# EAGLE design 2019-02-10-can-display-v7 (EAGLE 9.3.0)

## Sheet 1 of 2
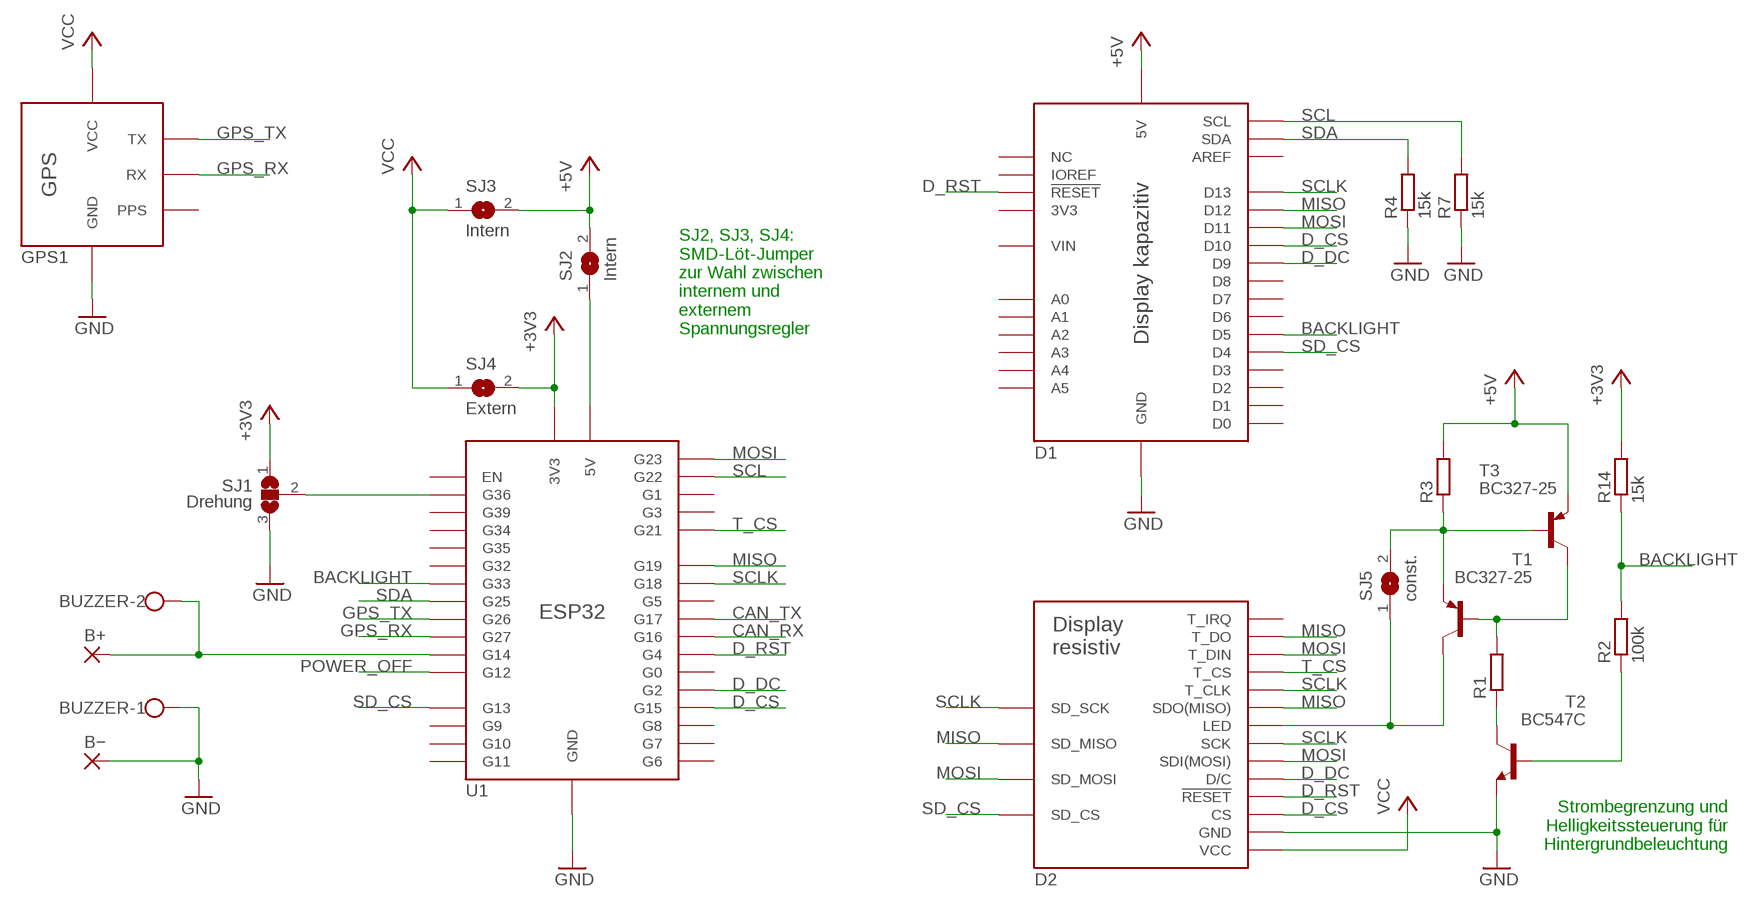
[diagram p0: schematic, sheet 1]

### Parts
B+  WIREPADSMD5-2,5  [5-2,5]
BUZZER  W237-102  [W237-102]
B−  WIREPADSMD5-2,5  [5-2,5]
D1  TFT-KAPAZITIV  [TFT-KAPAZITIV]
D2  TFT-RESISTIV  [TFT-RESISTIVE]
GPS1  GPS  [GPS]
R1  R-EU_VMTA55  [VMTA55]
R2  100k  R-EU_VMTA55  [VMTA55]
R3  R-EU_VMTA55  [VMTA55]
R4  15k  R-EU_VMTA55  [VMTA55]
R7  15k  R-EU_VMTA55  [VMTA55]
R14  15k  R-EU_VMTA55  [VMTA55]
SJ1  Drehung  SJ2W  [SJ_2]
SJ2  Intern  SJ  [SJ]
SJ3  Intern  SJ  [SJ]
SJ4  Extern  SJ  [SJ]
SJ5  const.  SJ  [SJ]
T1  BC327-25  -PNP-TO92  [TO92]
T2  BC547C  -NPN-TO92  [TO92]
T3  BC327-25  -PNP-TO92  [TO92]
U1  ESP32  [ESP32]

### Nets
+3V3: R14.2 SJ1.1 SJ4.2 U1.3V3 U1.3V3S(3V3) ; also sheet 2
+5V: D1.5V R3.2 SJ2.2 SJ3.2 T3.1(E) ; also sheet 2
BACKLIGHT: D1.D5 R2.2 R14.1 U1.G33 U1.G33S(G33)
CAN_RX: U1.G16 ; also sheet 2
CAN_TX: U1.G17 ; also sheet 2
D_CS: D1.D10 D2.LCD_CS(CS) U1.G15
D_DC: D1.D9 D2.LCD_DC(D/C) U1.G2
D_RST: D1.RESET(!RESET!) D2.LCD_RESET(!RESET!) U1.G4
GND: BUZZER.1 B−.1(P) D1.GND@1(GND) D1.GND@2(GND) D1.GND@3(GND) D2.GND GPS1.GND1(GND) GPS1.GND2(GND) R4.1 R7.1 SJ1.3 T2.1(E) U1.GND@1(GND) U1.GND@2(GND) U1.GND@3(GND) U1.GND@4(GND) ; also sheet 2
GPS_RX: GPS1.RX1(RX) GPS1.RX2(RX) U1.G27 U1.G27S(G27)
GPS_TX: GPS1.TX1(TX) GPS1.TX2(TX) U1.G26 U1.G26S(G26)
MISO: D1.D12 D2.LCD_MISO(SDO(MISO)) D2.SD_MISO D2.T_DO U1.G19
MOSI: D1.D11 D2.LCD_MOSI(SDI(MOSI)) D2.SD_MOSI D2.T_DIN U1.G23
N$1: SJ1.2 U1.G36 U1.G36S(G36)
N$2: R1.2 T1.2(B) T3.3(C)
N$3: R3.1 SJ5.2 T1.1(E) T3.2(B)
N$4: R2.1 T2.2(B)
N$5: R1.1 T2.3(C)
N$6: B+.1(P) BUZZER.2 U1.G14 U1.G14S(G14)
N$7: SJ2.1 U1.5V U1.5VS(5V)
N$12: D2.LED SJ5.1 T1.3(C)
POWER_OFF: U1.G12 U1.G12S(G12) ; also sheet 2
SCL: D1.KAP_SCL(SCL) R7.2 U1.G22
SCLK: D1.D13 D2.LCD_SCK(SCK) D2.SD_SCK D2.T_CLK U1.G18
SD_CS: D1.D4 D2.SD_CS U1.G13 U1.G13S(G13)
SDA: D1.KAP_SDA(SDA) R4.2 U1.G25 U1.G25S(G25)
T_CS: D2.T_CS U1.G21
VCC: D2.VCC GPS1.VCC1(VCC) GPS1.VCC2(VCC) SJ3.1 SJ4.1 ; also sheet 2
Unconnected: D1.3V3 D1.A0 D1.A1 D1.A2 D1.A3 D1.A4 D1.A5 D1.AREF D1.D0 D1.D1 D1.D2 D1.D3 D1.D6 D1.D7 D1.D8 D1.IOREF D1.NC@1(NC) D1.VIN D2.T_IRQ GPS1.PPS2(PPS) U1.EN U1.ENS(EN) U1.G0 U1.G1 U1.G3 U1.G5 U1.G6 U1.G7 U1.G8 U1.G9 U1.G9S(G9) U1.G10 U1.G10S(G10) U1.G11 U1.G11S(G11) U1.G32 U1.G32S(G32) U1.G34 U1.G34S(G34) U1.G35 U1.G35S(G35) U1.G39 U1.G39S(G39)

### Notes on the sheet
- SJ2, SJ3, SJ4:
  SMD-Löt-Jumper
  zur Wahl zwischen
  internem und
  externem
  Spannungsregler
- Strombegrenzung und
  Helligkeitssteuerung für
  Hintergrundbeleuchtung

## Sheet 2 of 2
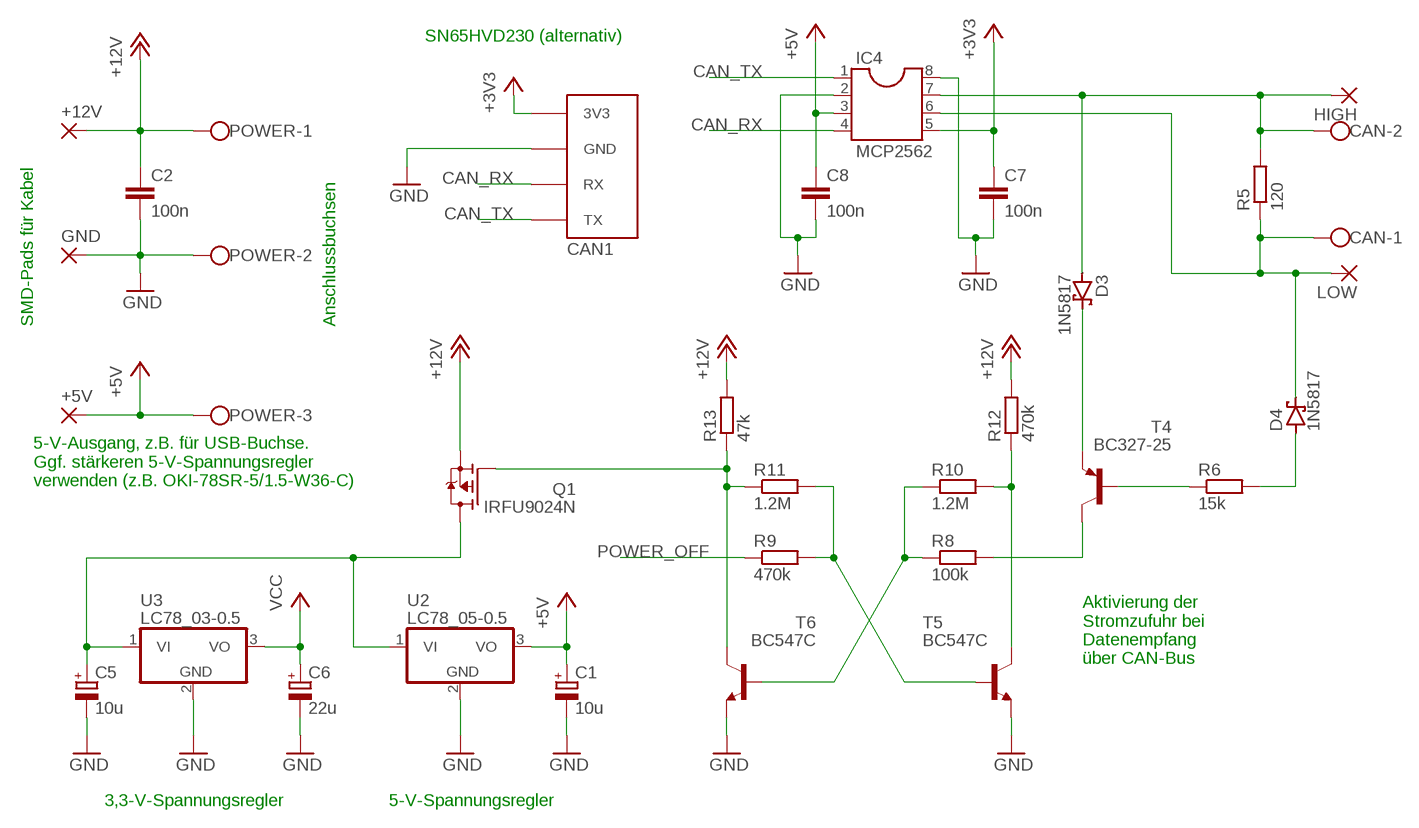
[diagram p1: schematic, sheet 2]

### Parts
+5V  WIREPADSMD5-2,5  [5-2,5]
+12V  WIREPADSMD5-2,5  [5-2,5]
C1  10u  CPOL-EUE1.8-4  [E1,8-4]
C2  100n  C-EU025_050-025X075  [C025_050-025X075]
C5  10u  CPOL-EUE1.8-4  [E1,8-4]
C6  22u  CPOL-EUE1.8-4  [E1,8-4]
C7  100n  C-EU025_050-025X075  [C025_050-025X075]
C8  100n  C-EU025_050-025X075  [C025_050-025X075]
CAN  W237-102  [W237-102]
CAN1  CANBUS  [CANBUS]
D3  1N5817  1N5817-T  [DO41-7.6]
D4  1N5817  1N5817-T  [DO41-7.6]
GND  WIREPADSMD5-2,5  [5-2,5]
HIGH  WIREPADSMD5-2,5  [5-2,5]
IC4  MCP2562  DIL8  [DIL08]
LOW  WIREPADSMD5-2,5  [5-2,5]
POWER  W237-103  [W237-103]
Q1  IRFU9024N  P-CHANNEL-MOSFET  [TO251AA-V]
R5  120  R-EU_VMTA55  [VMTA55]
R6  15k  R-EU_VMTA55  [VMTA55]
R8  100k  R-EU_VMTA55  [VMTA55]
R9  470k  R-EU_VMTA55  [VMTA55]
R10  1.2M  R-EU_VMTA55  [VMTA55]
R11  1.2M  R-EU_VMTA55  [VMTA55]
R12  470k  R-EU_VMTA55  [VMTA55]
R13  47k  R-EU_VMTA55  [VMTA55]
T4  BC327-25  -PNP-TO92  [TO92]
T5  BC547C  -NPN-TO92  [TO92]
T6  BC547C  -NPN-TO92  [TO92]
U2  LC78_05-0.5  SPANNUNGSREGLER  [SPANNUNGSREGLER]
U3  LC78_03-0.5  SPANNUNGSREGLER  [SPANNUNGSREGLER]

### Nets
+3V3: C7.1 CAN1.3V3 IC4.5 ; also sheet 1
+5V: +5V.1(P) C1.+ C8.1 IC4.3 POWER.3 U2.3(VO) ; also sheet 1
+12V: +12V.1(P) C2.1 POWER.1 Q1.3(S) R12.2 R13.2
CAN_RX: CAN1.RX IC4.4 ; also sheet 1
CAN_TX: CAN1.TX IC4.1 ; also sheet 1
GND: C1.- C2.2 C5.- C6.- C7.2 C8.2 CAN1.GND GND.1(P) IC4.2 IC4.8 POWER.2 T5.1(E) T6.1(E) U2.2(GND) U3.2(GND) ; also sheet 1
N$8: D3.C T4.1(E)
N$9: R6.1 T4.2(B)
N$10: D4.A R6.2
N$11: R8.1 R10.1 T6.2(B)
N$13: CAN.2 D3.A HIGH.1(P) IC4.7 R5.2
N$14: CAN.1 D4.C IC4.6 LOW.1(P) R5.1
N$15: R8.2 T4.3(C)
N$16: R9.2 R11.2 T5.2(B)
N$17: R10.2 R12.1 T5.3(C)
N$18: Q1.1(G) R11.1 R13.1 T6.3(C)
N$20: C5.+ Q1.2(D) U2.1(VI) U3.1(VI)
POWER_OFF: R9.1 ; also sheet 1
VCC: C6.+ U3.3(VO) ; also sheet 1

### Notes on the sheet
- SN65HVD230 (alternativ)
- SMD-Pads für Kabel | Anschlussbuchsen
- 5-V-Ausgang, z.B. für USB-Buchse.
  Ggf. stärkeren 5-V-Spannungsregler
  verwenden (z.B. OKI-78SR-5/1.5-W36-C)
- Aktivierung der
  Stromzufuhr bei
  Datenempfang
  über CAN-Bus
- 3,3-V-Spannungsregler | 5-V-Spannungsregler

## Library data of the parts
+5V +12V B+ B− GND HIGH LOW = wirepad:WIREPAD: Wire PAD connect wire on PCB
BUZZER CAN = con-wago-500:W237-102: WAGO SCREW CLAMP; MPN: 237-102; OC_FARNELL: unknown; OC_NEWARK: 70K9898
C1 C5 C6 = rcl:CPOL-EU: POLARIZED CAPACITOR, European symbol; SPICEPREFIX: C
C2 C7 C8 = rcl:C-EU: CAPACITOR, European symbol; SPICEPREFIX: C
CAN1 = CAN-Display:CANBUS: CAN BUS
D1 = CAN-Display:TFT-KAPAZITIV: TFT-Kapazitiv
D2 = CAN-Display:TFT-RESISTIV: TFT-Resistiv
D3 D4 = diode:1N581*: 1.0A SCHOTTKY BARRIER RECTIFIER Source: http://www.diodes.com/datasheets/ds23001.pdf
GPS1 = CAN-Display:GPS: GPS
IC4 = ic-package:DIL8: Dual In Line / Socket
POWER = con-wago-500:W237-103: WAGO SCREW CLAMP; MPN: 237-103; OC_FARNELL: unknown; OC_NEWARK: 18M7116
Q1 = CAN-Display:P-CHANNEL-MOSFET
R1-R14 = rcl:R-EU_: RESISTOR, European symbol; SPICEPREFIX: R
SJ1 = jumper:SJ2W: SMD solder JUMPER
SJ2-SJ5 = jumper:SJ: SMD solder JUMPER
T1 T3 T4 = transistor:*-PNP-: PNP Transistror
T2 T5 T6 = transistor:*-NPN-: NPN Transistror BF959 corrected 2008.03.06
U1 = CAN-Display:ESP32: ESP32 Development Board
U2 U3 = CAN-Display:SPANNUNGSREGLER

## Board
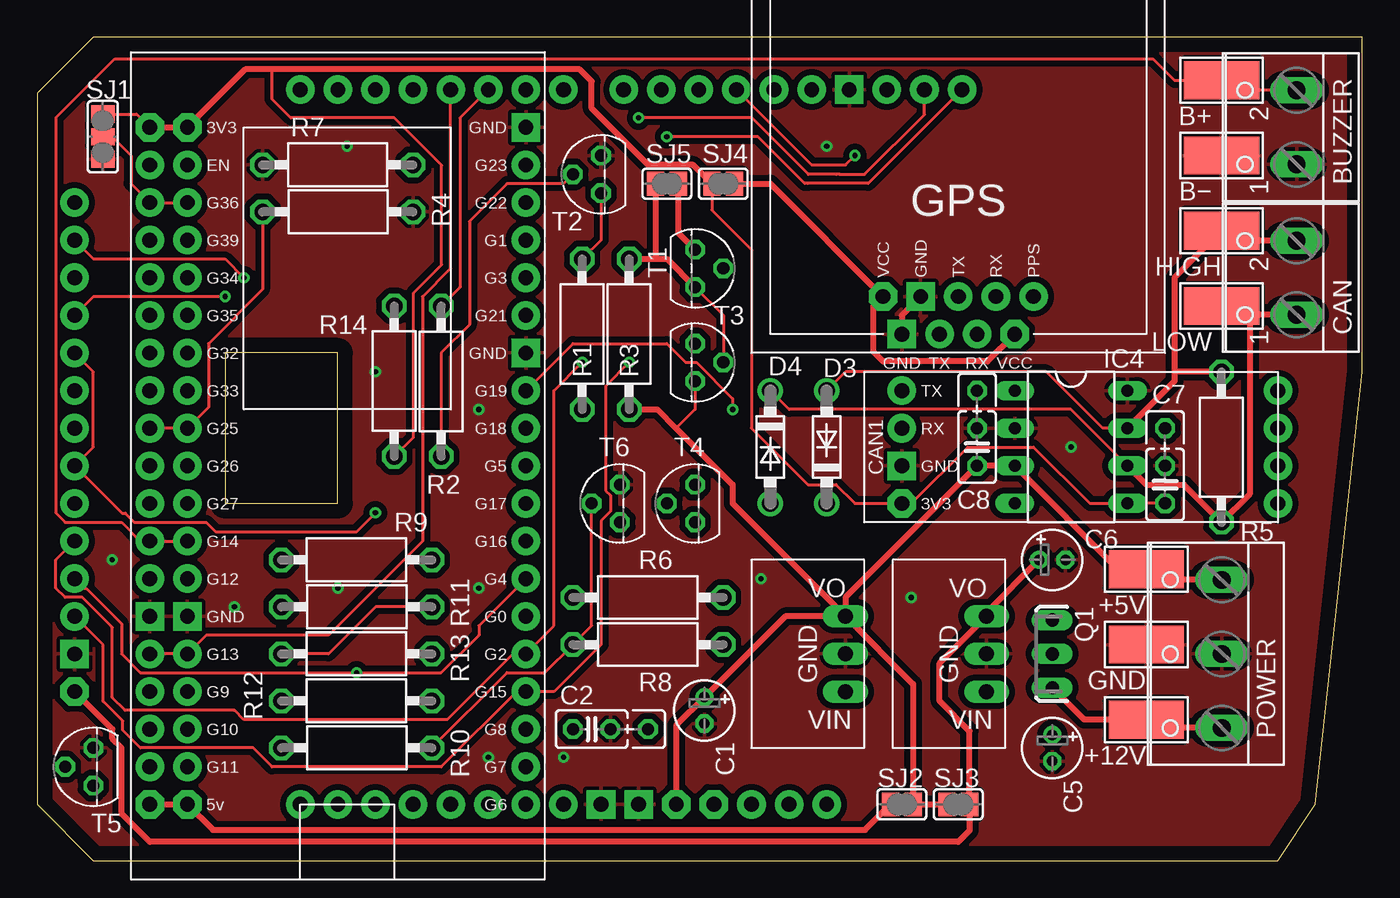
[diagram p2: board, top side]
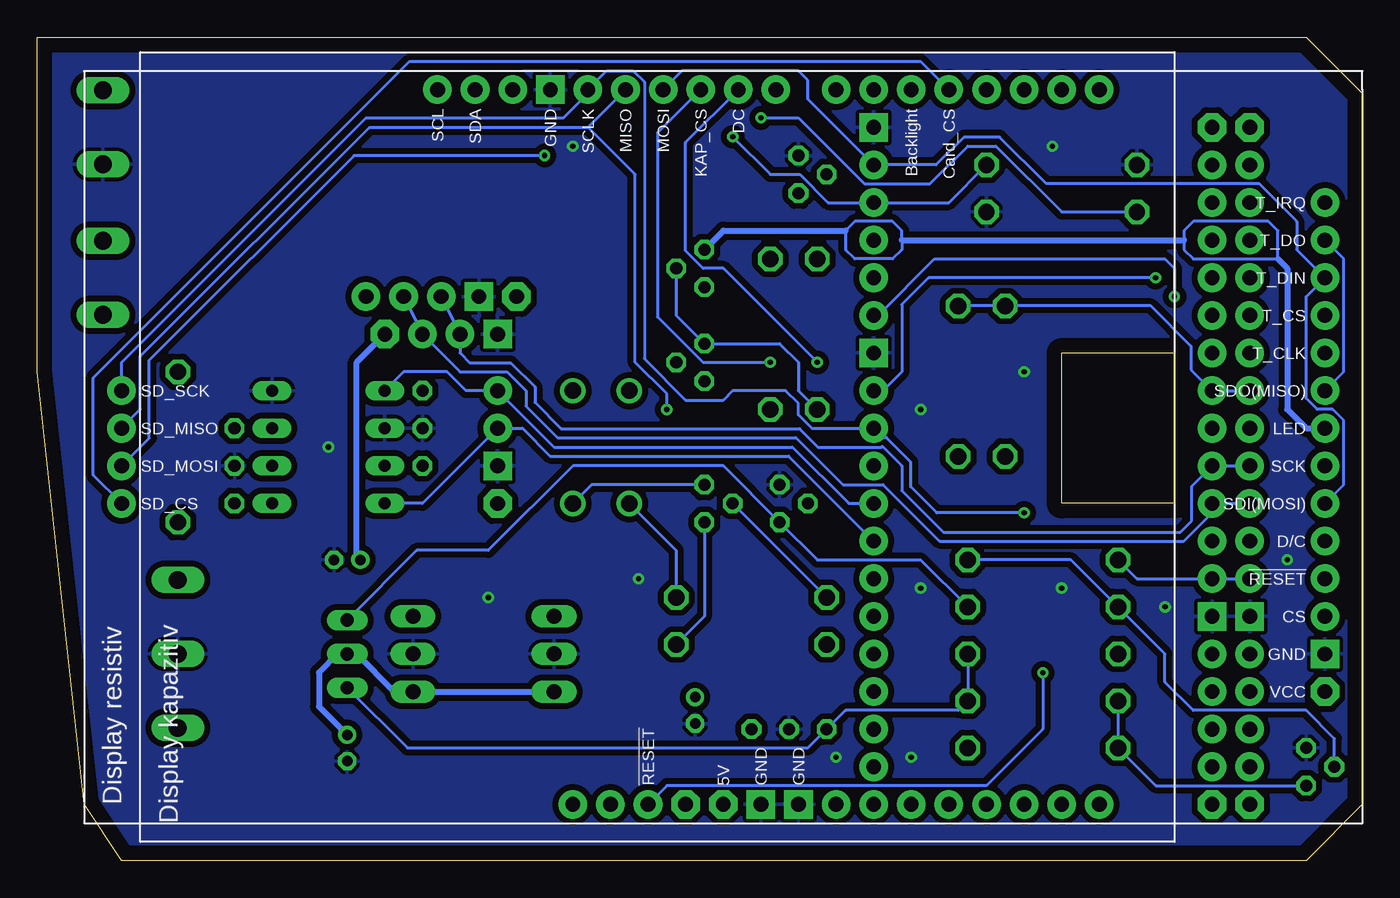
[diagram p3: board, bottom side, seen from below]

Size 89.53 x 55.63 mm. Coordinates in mm from the lower left corner, seen from the top.
Outline: 0,3.81 3.81,0 83.82,0 86.36,3.81 89.53,33.02 89.53,55.63 3.81,55.63 0,51.82 0,3.81
Outline: 20.32,34.29 12.7,34.29 12.7,24.13 20.32,24.13 20.32,34.29
Copper layers (1*16): Top 0.035mm / dielectric 1.5mm / Bottom 0.035mm
Design rules "default *": minimum track width 6mil, minimum drill 0.35mm, track to track 16mil, track to pad 8mil, pad to pad 10mil, via to via 20mil, smd to smd 6mil, copper to edge 40mil, drill to drill 6mil, minimum pad ring 10mil, minimum via ring 8mil, stop-mask expansion 4mil, vias tented up to drill 0mil, thermal gap 10mil

### Footprints (pad centres in the part's own frame; a part is rotated, then mirrored left to right if it is on the bottom)
5-2,5 = smd 2.54 x 5.08: 1 0,0
W237-102 = drill 1.194 long: 1 -2.5,-1.27; 2 2.5,-1.27
E1,8-4 = drill 0.711 pad 1.168: + -0.889,0 | drill 0.711 pad 1.168 octagon: - 0.889,0
C025_050-025X075 = drill 0.813 octagon: 1 -1.27,0; 2 1.27,0; 3 3.81,0
CANBUS = drill 1 pad 1.93 octagon: 3V3 -2.54,-3.81 | drill 1 pad 1.93 square: GND -2.54,-1.27 | drill 1 pad 1.93: RX -2.54,1.27; TX -2.54,3.81
TFT-KAPAZITIV = drill 1 pad 1.93 octagon: 3V3 1.27,-24.13; 5V 3.81,-24.13 | drill 1 pad 1.93: A0 16.51,-24.13; A1 19.05,-24.13; A2 21.59,-24.13; A3 24.13,-24.13; A4 26.67,-24.13; A5 29.21,-24.13; AREF -10.414,24.13; D0 29.21,24.13; D1 26.67,24.13; D2 24.13,24.13; D3 21.59,24.13; D4 19.05,24.13; D5 16.51,24.13; D6 13.97,24.13; D7 11.43,24.13; D8 7.366,24.13; D9 4.826,24.13; D10 2.286,24.13; D11 -0.254,24.13; D12 -2.794,24.13; D13 -5.334,24.13; IOREF -3.81,-24.13; KAP_SCL -15.494,24.13; KAP_SDA -12.954,24.13; NC@1 -6.35,-24.13; RESET -1.27,-24.13; VIN 11.43,-24.13 | drill 1 pad 1.93 square: GND@1 6.35,-24.13; GND@2 8.89,-24.13; GND@3 -7.874,24.13
TFT-RESISTIVE = drill 1 pad 1.93 square: GND 0,-13.97 | drill 1 pad 1.93: LCD_CS 0,-11.43; LCD_DC 0,-6.35; LCD_MISO 0,3.81; LCD_MOSI 0,-3.81; LCD_RESET 0,-8.89; LCD_SCK 0,-1.27; LED 0,1.27; SD_CS -81.28,-3.81; SD_MISO -81.28,1.27; SD_MOSI -81.28,-1.27; SD_SCK -81.28,3.81; T_CLK 0,6.35; T_CS 0,8.89; T_DIN 0,11.43; T_DO 0,13.97; T_IRQ 0,16.51 | drill 1 pad 1.93 octagon: VCC 0,-16.51
DO41-7.6 = drill 1.1 pad 1.7: A 3.81,0; C -3.81,0
GPS = drill 1 pad 1.93 square: GND1 3.81,0; GND2 2.54,-2.54 | drill 1 pad 1.93: PPS2 -5.08,-2.54; RX1 -1.27,0; RX2 -2.54,-2.54; TX1 1.27,0; TX2 0,-2.54 | drill 1 pad 1.93 octagon: VCC1 -3.81,0; VCC2 5.08,-2.54
DIL08 = drill 0.813 long: 1 -3.81,-3.81; 2 -1.27,-3.81; 3 1.27,-3.81; 4 3.81,-3.81; 5 3.81,3.81; 6 1.27,3.81; 7 -1.27,3.81; 8 -3.81,3.81
W237-103 = drill 1.194 long: 1 -5,-1.29; 2 0,-1.29; 3 5,-1.29
TO251AA-V = drill 0.889 long: 1 -2.286,0; 2 0,0; 3 2.286,0
VMTA55 = drill 1.1 octagon: 1 -5.08,0; 2 5.08,0
SJ_2 = smd 1.168 x 1.6: 1 -1.524,0; 2 0,0; 3 1.524,0
SJ = smd 1.168 x 1.6: 1 -0.762,0; 2 0.762,0
TO92 = drill 0.813 octagon: 1 1.27,0; 2 0,1.905; 3 -1.27,0
ESP32 = drill 1 pad 1.93 octagon: 3V3 -12.7,20.32; 3V3S -10.16,20.32; 5V -12.7,-25.4; 5VS -10.16,-25.4 | drill 1 pad 1.93: EN -12.7,17.78; ENS -10.16,17.78; G0 12.7,-12.7; G1 12.7,12.7; G2 12.7,-15.24; G3 12.7,10.16; G4 12.7,-10.16; G5 12.7,-2.54; G6 12.7,-25.4; G7 12.7,-22.86; G8 12.7,-20.32; G9 -12.7,-17.78; G9S -10.16,-17.78; G10 -12.7,-20.32; G10S -10.16,-20.32; G11 -12.7,-22.86; G11S -10.16,-22.86; G12 -12.7,-10.16; G12S -10.16,-10.16; G13 -12.7,-15.24; G13S -10.16,-15.24; G14 -12.7,-7.62; G14S -10.16,-7.62; G15 12.7,-17.78; G16 12.7,-7.62; G17 12.7,-5.08; G18 12.7,0; G19 12.7,2.54; G21 12.7,7.62; G22 12.7,15.24; G23 12.7,17.78; G25 -12.7,0; G25S -10.16,0; G26 -12.7,-2.54; G26S -10.16,-2.54; G27 -12.7,-5.08; G27S -10.16,-5.08; G32 -12.7,5.08; G32S -10.16,5.08; G33 -12.7,2.54; G33S -10.16,2.54; G34 -12.7,10.16; G34S -10.16,10.16; G35 -12.7,7.62; G35S -10.16,7.62; G36 -12.7,15.24; G36S -10.16,15.24; G39 -12.7,12.7; G39S -10.16,12.7 | drill 1 pad 1.93 square: GND@1 -12.7,-12.7; GND@2 12.7,5.08; GND@3 12.7,20.32; GND@4 -10.16,-12.7
SPANNUNGSREGLER = drill 1.016 long: 1 -2.54,-2.54; 2 0,-2.54; 3 2.54,-2.54

### Placement (x,y rotation side)
+5V  74.93,19.68 90 top
+12V  74.93,9.53 90 top
B+  80.01,52.7 270 top
BUZZER  83.82,49.53 90 top
B−  80.01,47.62 90 top
C1  45.09,10.16 270 top
C2  37.47,8.89 0 top
C5  68.58,7.62 270 top
C6  68.58,20.32 0 top
C7  76.2,25.4 90 top
C8  63.5,27.94 90 top
CAN  83.82,39.37 90 top
CAN1  60.96,27.94 0 top
D1  46.99,27.94 0 bottom
D2  2.54,27.94 0 bottom
D3  53.34,27.94 90 top
D4  49.53,27.94 270 top
GND  74.93,14.61 90 top
GPS1  62.23,35.56 180 top
HIGH  80.01,42.55 90 top
IC4  69.85,27.94 270 top
LOW  80.01,37.47 90 top
POWER  78.74,13.97 90 top
Q1  68.58,13.97 270 top
R1  36.83,35.56 270 top
R2  27.3,32.38 90 top
R3  40.01,35.56 270 top
R4  20.32,43.81 180 top
R5  80.01,27.94 90 top
R6  41.27,17.78 0 top
R7  20.32,46.99 0 top
R8  41.27,14.61 0 top
R9  21.59,20.32 0 top
R10  21.59,7.62 180 top
R11  21.59,17.14 180 top
R12  21.59,10.79 0 top
R13  21.59,13.97 0 top
R14  24.13,32.38 270 top
SJ1  4.45,48.9 270 top
SJ2  58.42,3.81 0 top
SJ3  62.23,3.81 180 top
SJ4  46.35,45.72 180 top
SJ5  42.55,45.72 180 top
T1  44.45,40.01 270 top
T2  38.1,46.35 90 top
T3  44.45,33.66 270 top
T4  44.45,24.13 90 top
T5  3.81,6.35 90 top
T6  39.37,24.13 90 top
U1  20.32,29.21 0 top
U2  52.07,13.97 90 top
U3  61.59,13.97 90 top

### Tracks (layer width: path | path; a pad name or v marks a point on that pad's centre or on a via)
+3V3
  Top 0.203: SJ1.1 6.73,50.42 U1.3V3 | SJ4.2 45.59,43.94 48.26,41.27 48.26,29.21 52.07,25.4 53.98,25.4 55.24,24.13 CAN1.3V3 59.05,24.13 62.87,27.94 67.31,27.94 71.12,24.13 IC4.5 C7.1 | R14.2 25.43,28.6 25.43,38.35 27.33,40.26 27.33,46.97 24.13,50.16 17.14,50.16 15.88,51.44 15.88,53.44
  Top 0.406: U1.3V3 U1.3V3S 14.07,53.44 15.88,53.44 36.65,53.44 37.47,52.63 37.47,50.8 41.27,46.99 44.32,46.99 SJ4.2
+5V
  Top 0.203: T3.1 44.45,30.48 43.18,29.21
  Top 0.406: POWER.3 75.64,18.97 +5V.1 73.03,19.68 IC4.3 C8.1 54.61,17.78 U2.3 | U2.3 50.55,16.51 C1.+ 43.18,9.14 D1.5V | U2.3 59.18,11.94 SJ2.2 SJ3.2 | R3.2 41.91,30.48 43.18,29.21 46.99,25.4 46.99,24.13 U2.3
+12V
  Top 0.406: POWER.1 75.48,8.97 +12V.1 70.74,9.53 Q1.3
  Bottom 0.203: Q1.3 64.52,7.62 37.47,7.62 C2.1 34.92,10.16 27.3,10.16 R12.2 R13.2
BACKLIGHT
  Top 0.203: D1.D5 28.57,50.16 28.57,38.73 R2.2
  Bottom 0.203: U1.G33 U1.G33S 11.58,33.17 11.58,34.75 14.29,37.47 R14.1 R2.2
CAN_RX
  Bottom 0.203: U1.G16 38.76,27.33 54.86,27.33 56.74,29.21 CAN1.RX 63.5,24.13 IC4.4
CAN_TX
  Bottom 0.203: U1.G17 34.7,24.13 38.51,27.94 54.61,27.94 CAN1.TX 60.55,31.75 61.82,33.02 64.77,33.02 IC4.1
D_CS  (via drill 0.35)
  Top 0.203: v40.01,33.66 38.41,32.05 38.41,25 38.73,24.67 38.73,23.59 38.1,22.95 38.1,14.61 34.92,11.43 U1.G15 32.38,11.43 27.3,6.35 15.88,6.35 14.61,7.62 6.99,7.62 5.79,8.81 5.79,9.45 4.47,10.77 4.47,14.58 D2.LCD_CS
  Bottom 0.203: D1.D10 47.62,49.15 47.62,36.73 44.55,33.66 v40.01,33.66
D_DC  (via drill 0.35)
  Top 0.203: v36.83,33.66 34.92,31.75 34.92,15.88 U1.G2 32.16,13.97 27.71,9.53 13.97,9.53 13.34,10.16 5.94,10.16 5.08,11.02 5.08,15.77 3.07,17.78 1.91,17.78 1.27,18.41 1.27,20.32 D2.LCD_DC
  Bottom 0.203: v36.83,33.66 43.18,40.01 44.55,40.01 45.72,41.18 45.72,48.51 D1.D9
D_RST  (via drill 0.35)
  Top 0.203: U1.G4 29.84,15.88 29.84,15.24 27.3,12.7 v21.59,12.7 6.99,12.7 5.71,13.97 5.71,15.99 3.32,18.39 3.2,18.39 D2.LCD_RESET
  Bottom 0.203: D1.RESET 46.99,5.08 25.4,5.08 21.59,8.89 v21.59,12.7
GND  (via drill 0.35)
  Top 0.406: GPS1.GND2 58.42,36.83 GPS1.GND1
  other vias: 53.34,48.26 29.84,30.48 22.86,33.02 5.08,20.32 13.34,17.14 29.84,18.41 30.48,6.99 35.56,6.99 48.9,19.05 59.05,17.78 20.32,18.41 69.85,27.94 20.95,48.26
  pour Top: -3.17,0.64 0,-2.54 87,-2.54 92.71,3.17 92.71,58.42 1.27,58.42 -3.17,53.98
  pour Bottom: -5.08,55.24 -5.08,0 0.64,-5.71 88.9,-5.71 97.16,2.54 97.16,60.96 0.64,60.96
GPS_RX
  Bottom 0.203: GPS1.RX2 GPS1.RX1 60.96,33.02 57.78,33.02 56.52,31.75 56.52,30.71 54.38,28.57 38.28,28.57 35.11,25.4 32.38,25.4 28.57,21.59 12.06,21.59 10.16,23.5 U1.G27S U1.G27
GPS_TX
  Bottom 0.203: GPS1.TX2 GPS1.TX1 60.96,34.29 60.3,33.63 57.53,33.63 55.91,32 55.91,30.96 54.13,29.18 38.03,29.18 36.78,27.94 32.49,27.94 32.47,27.96 32.41,27.96 31.11,26.67 31.11,24.99 28.32,22.2 12.32,22.2 11.54,22.97 11.54,25.29 U1.G26S U1.G26
MISO  (via drill 0.35)
  Top 0.203: U1.G19 36.2,34.92 42.55,34.92 43.81,33.66 44.55,33.66 46.99,31.21 v46.99,30.48 | D2.T_DO 3.81,40.64 12.7,40.64 v13.97,39.37
  Bottom 0.203: D2.SD_MISO 82.55,30.48 82.55,34.06 67.08,49.53 52.32,49.53 | 52.32,49.53 D1.D12 | v46.99,30.48 46.99,31.52 49.12,33.66 49.12,46.35 52.3,49.53 52.32,49.53 | D2.LCD_MISO 1.27,33.02 1.27,40.64 D2.T_DO | U1.G19 32.38,31.75 31.11,33.02 31.11,37.57 29.31,39.37 v13.97,39.37
MOSI  (via drill 0.35)
  Top 0.203: D1.D11 52.32,46.99 54.61,46.99 v55.24,47.62
  Bottom 0.203: D2.SD_MOSI 81.94,28.55 81.94,33.81 68.13,47.62 v55.24,47.62 | D1.D11 45.97,53.34 38.1,53.34 37.47,52.7 37.47,51.44 U1.G23 28.8,46.99 26.92,48.87 24.51,48.87 21.36,45.72 6.99,45.72 4.45,43.18 4.45,41.27 D2.T_DIN 3.81,38.1 3.81,31.22 3.07,30.48 2.01,30.48 1.27,29.74 1.27,25.4 D2.LCD_MOSI
N$1
  Top 0.203: SJ1.2 5.08,48.9 6.35,47.62 6.35,45.72 U1.G36 U1.G36S
N$2
  Bottom 0.203: T1.2 46.35,36.83 T3.3 39.37,34.92 38.1,33.66 38.1,31.75 R1.2
N$3
  Top 0.203: T1.1 46.35,36.83 T3.2
  Top 0.406: R3.1 41.91,40.64 | 41.91,40.64 42.55,40.64 T1.1 | 41.91,40.64 41.78,40.77 SJ5.2
N$4
  Top 0.203: R2.1 27.3,34.29 29.21,36.2 29.21,43.18 31.75,45.72 35.56,45.72 T2.2
N$5
  Top 0.203: T2.3 38.1,41.91 R1.1
N$6
  Top 0.203: U1.G14S U1.G14 6.99,21.59 5.71,22.86 1.91,22.86 1.27,23.5 1.27,50.16 5.26,54.15 75.39,54.15 76.83,52.7 B+.1 80.69,52.03 BUZZER.2
N$7
  Top 0.406: U1.5V U1.5VS 11.89,2.08 55.93,2.08 SJ2.1
N$8
  Bottom 0.203: T4.1 52.07,25.4 D3.C
N$9
  Bottom 0.203: T4.2 R6.1
N$10
  Bottom 0.203: D4.A 46.35,20.95 R6.2
N$11
  Top 0.203: R10.1 31.75,12.7 34.29,12.7 R8.1 37.47,15.88 T6.2
N$12
  Top 0.406: SJ5.1 43.31,42.42 T1.3
  Bottom 0.203: 34.92,42.55 34.92,41.27 34.29,40.64 31.75,40.64 31.11,41.27 31.11,41.91 31.11,42.55 31.75,43.18 34.29,43.18 34.92,42.55 | 12.06,41.91 12.06,41.27 11.43,40.64 5.71,40.64 5.71,42.55 6.35,43.18 11.43,43.18 12.06,42.55 12.06,41.91
  Bottom 0.406: T1.3 43.18,42.55 34.92,42.55 | 31.11,41.91 12.06,41.91 | 5.71,40.64 5.08,40.01 5.08,30.48 3.81,29.21 D2.LED
N$13
  Top 0.203: D3.A 54.61,33.02 68.17,33.02 71.98,29.21 IC4.7
  Top 0.406: CAN.2 80.69,41.87 HIGH.1 76.83,39.37 76.83,33.02 | IC4.7 76.83,32.38 76.83,33.02 | R5.2 76.83,33.02
N$14
  Top 0.203: IC4.6 69.85,30.48 50.8,30.48 D4.C
  Top 0.406: CAN.1 80.61,36.87 LOW.1 81.92,37.47 81.92,24.77 R5.1 77.47,25.4 74.93,25.4 IC4.6
N$15
  Bottom 0.203: T4.3 44.45,16.51 R8.2
N$16
  Bottom 0.203: T5.2 1.91,8.26 3.81,10.16 11.43,10.16 13.34,12.06 13.34,13.97 R11.2 19.68,20.32 R9.2
N$17
  Bottom 0.203: R12.1 R10.2 13.97,5.08 T5.3
N$18
  Top 0.203: R13.1 19.68,13.97 22.86,17.14 R11.1
  Bottom 0.203: Q1.1 63.88,20.95 59.05,20.95 53.34,26.67 43.18,26.67 T6.3 36.83,20.32 29.84,20.32 R11.1
N$20
  Bottom 0.406: U2.1 U3.1 65.41,11.43 67.94,13.97 Q1.2 69.22,13.97 70.48,12.7 70.48,10.41 C5.+
POWER_OFF
  Bottom 0.203: R9.1 15.24,19.05 U1.G12S U1.G12
SCL  (via drill 0.35)
  Top 0.203: D1.KAP_SCL 56.16,45.74 52.07,45.74 51.84,45.74 48.7,48.9 v42.55,48.9
  Bottom 0.203: R7.2 27.94,44.45 U1.G22 36.1,44.45 38.01,46.35 40.01,46.35 v42.55,48.9
SCLK  (via drill 0.35)
  Top 0.203: v22.86,23.5 21.59,22.23 12.06,22.23 11.43,22.86 6.58,22.86 5.97,23.47 5.74,23.47 D2.LCD_SCK 3.81,27.94 3.81,33.02 D2.T_CLK
  Bottom 0.203: D2.SD_SCK 83.82,33.66 67.31,50.16 53.98,50.16 52.32,51.82 D1.D13 51.05,53.34 49.26,53.34 48.51,52.6 48.51,33.91 45.72,31.11 43.18,31.11 42.55,31.75 38.96,31.75 38.1,30.89 38.1,30.12 37.19,29.21 U1.G18 32.38,28.57 32.16,28.57 30.5,26.92 30.5,25.25 28.76,23.5 v22.86,23.5
SD_CS
  Top 0.203: U1.G13 U1.G13S 11.43,15.24 19.68,15.24 26.04,21.59 26.04,38.1 27.94,40.01 D1.D4
  Bottom 0.203: D2.SD_CS 85.72,26.04 85.72,32.61 64.36,53.98 29.84,53.98 D1.D4
SDA  (via drill 0.35)
  Top 0.203: U1.G25 U1.G25S 11.58,30.63 11.58,34.92 15.24,38.58 R4.2 | v40.64,50.16 48.29,50.16 52.1,46.35 53.98,46.35 54.23,46.35 55.91,46.35 59.94,50.39 D1.KAP_SDA
  Bottom 0.203: v40.64,50.16 38.1,50.16 33.66,45.72 29.21,45.72 26.67,48.26 24.77,48.26 20.32,43.81 R4.2
T_CS  (via drill 0.35)
  Top 0.203: v12.7,38.1 3.81,38.1 D2.T_CS
  Bottom 0.203: U1.G21 32.71,36.83 28.9,40.64 13.34,40.64 12.7,40.01 v12.7,38.1
VCC
  Top 0.406: C6.+ 64.14,16.76 U3.3 60.96,13.34 60.96,10.79 62.99,8.76 SJ3.1 62.99,2.03 62.23,1.27 7.62,1.27 5.71,3.17 5.71,7.62 5.08,8.26 5.08,8.89 D2.VCC | SJ4.1 49.53,45.72 GPS1.VCC2 56.52,37.47 56.52,34.37 57.15,33.73 64.21,33.73 GPS1.VCC1
  Bottom 0.406: C6.+ 67.94,20.57 67.94,33.66 GPS1.VCC1